# EAGLE design riffle-0.8 (EAGLE 7.2.0)
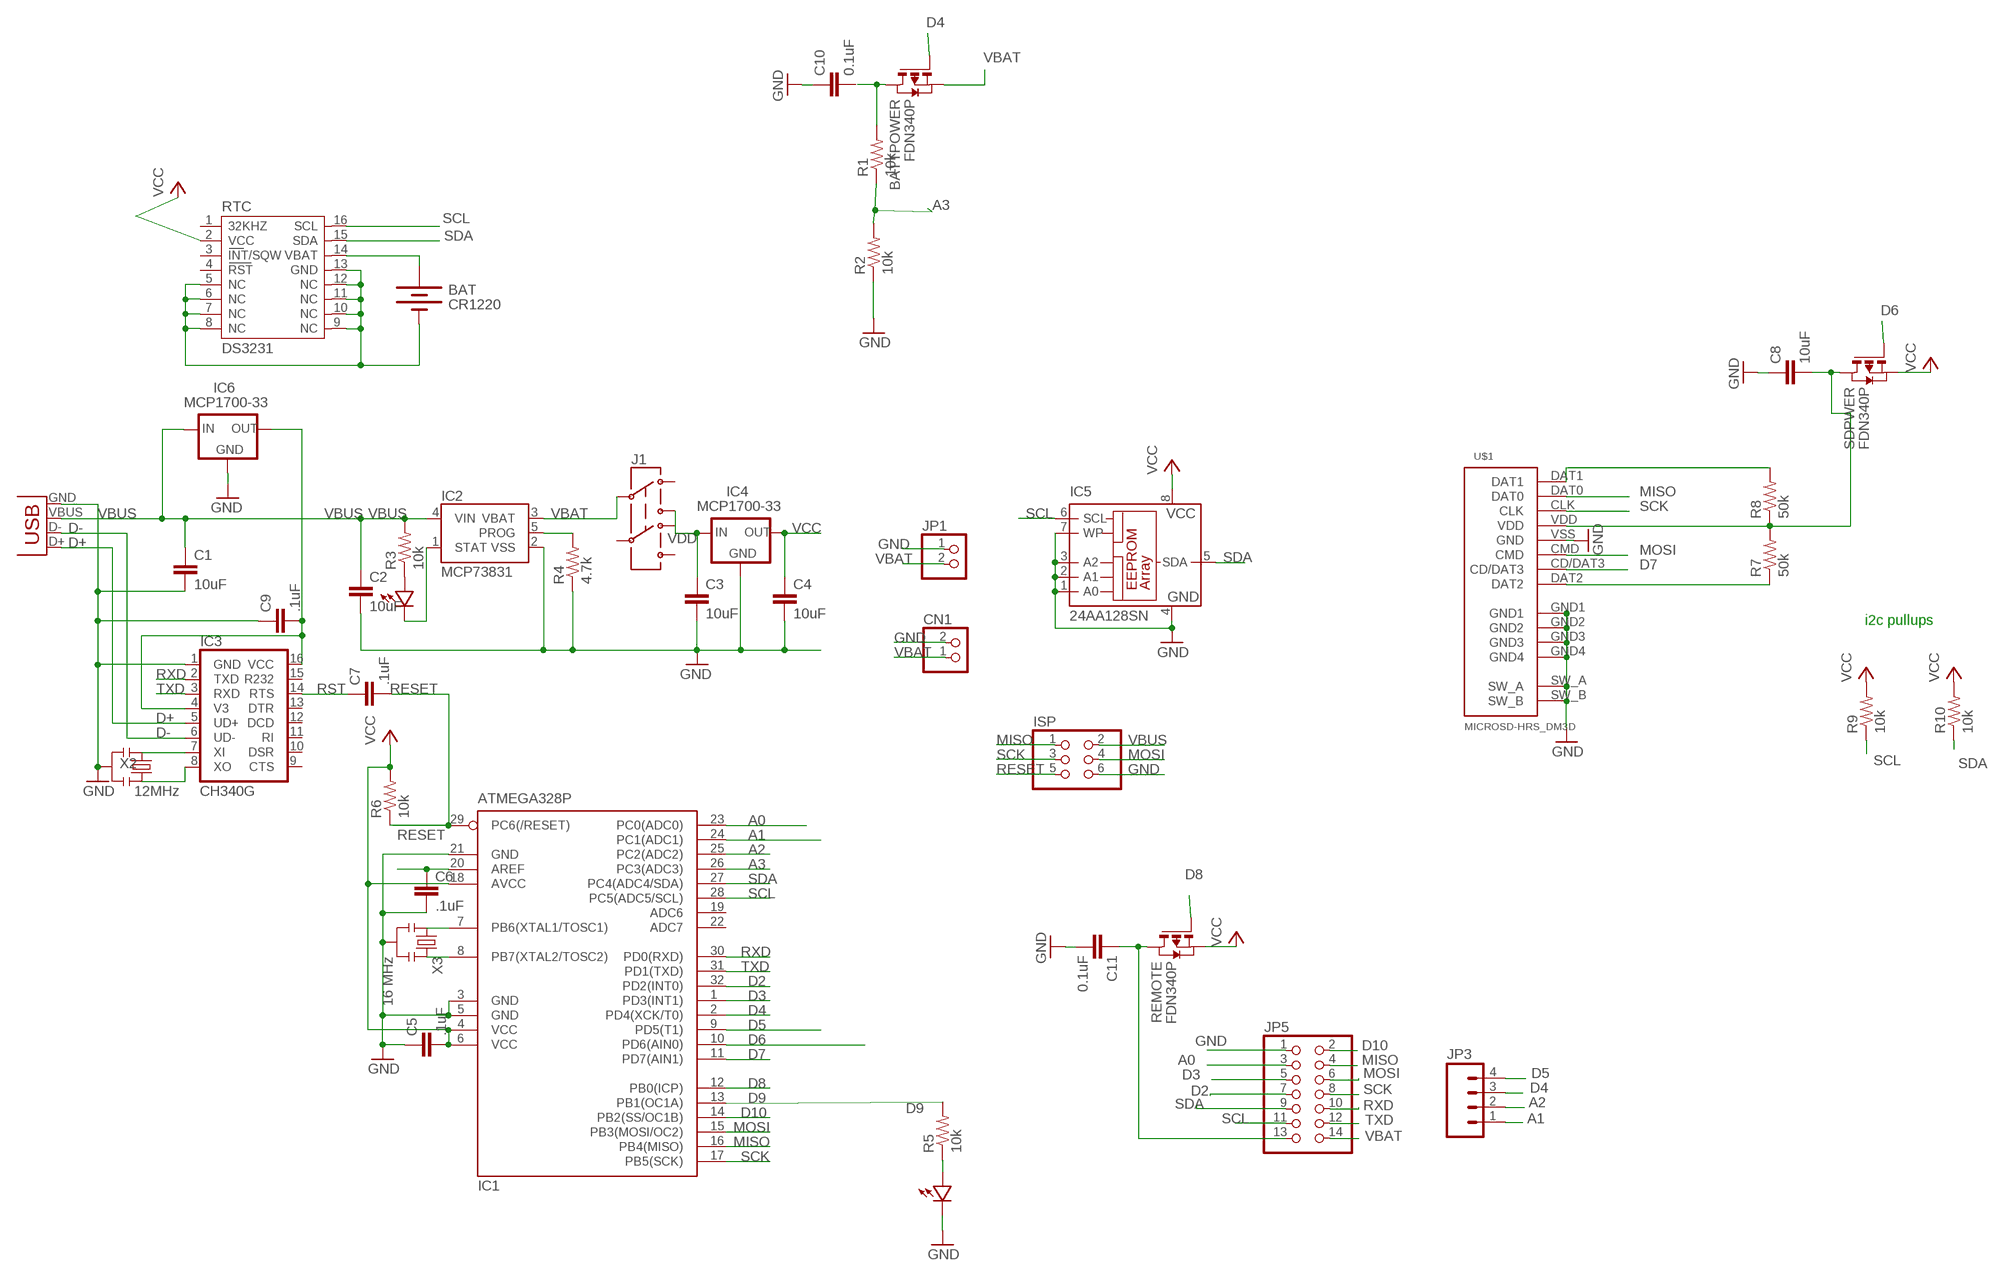
[diagram p0: schematic, sheet 1]

## Parts
BAT  CR1220  BATTERYBATTERY_12MM_SMT  [BATTCON_12MM_SMT]
BATTPOWER  FDN340P  PMOSSOT23  [SOT-23]
C1  10uF  CAP0402-CAP  [0402-CAP]
C2  10uF  CAP0402-CAP  [0402-CAP]
C3  10uF  CAP0402-CAP  [0402-CAP]
C4  10uF  CAP0402-CAP  [0402-CAP]
C5  .1uF  CAP0402-CAP  [0402-CAP]
C6  .1uF  CAP0402-CAP  [0402-CAP]
C7  .1uF  CAP0402-CAP  [0402-CAP]
C8  10uF  CAP0402-CAP  [0402-CAP]
C9  .1uF  CAP0402-CAP  [0402-CAP]
C10  0.1uF  CAP0402-CAP  [0402-CAP]
C11  0.1uF  CAP0402-CAP  [0402-CAP]
CHG  LED0603  [0603-LED]
CN1  JST_2PIN-SMT-RA  [JST-PH-2-SMT-RA]
IC1  ATMEGA328P  MEGA8-AI  [TQFP32-08]
IC2  MCP73831  [SOT23-5]
IC3  CH340G  [SO16]
IC4  MCP1700-33  MCP1700SOT89  [SOT89]
IC5  24AA128SN  [SO-08]
IC6  MCP1700-33  MCP1700SOT89  [SOT89]
ISP  PINHD-2X3  [2X03]
J1  AYZ0202  [AYZ0202]
JP1  PINHD-1X2  [1X02]
JP3  M04SMD  [1X04-SMD]
JP5  PINHD-2X7  [2X07]
R1  10k  RESISTOR0402-RES  [0402-RES]
R2  10k  RESISTOR0402-RES  [0402-RES]
R3  10k  RESISTOR0402-RES  [0402-RES]
R4  4.7k  RESISTOR0402-RES  [0402-RES]
R5  10k  RESISTOR0402-RES  [0402-RES]
R6  10k  RESISTOR0402-RES  [0402-RES]
R7  50k  RESISTOR0402-RES  [0402-RES]
R8  50k  RESISTOR0402-RES  [0402-RES]
R9  10k  RESISTOR0402-RES  [0402-RES]
R10  10k  RESISTOR0402-RES  [0402-RES]
REMOTE  FDN340P  PMOSSOT23  [SOT-23]
RTC  DS3231  [DS3231]
SDPWER  FDN340P  PMOSSOT23  [SOT-23]
STAT  LED0603  [0603-LED]
U$1  MICROSD-HRS_DM3D  [DM3D]
X1  USBSMD  [USB-MINIB]
X2  12MHz  RESONATORSMD  [RESONATOR-SMD]
X3  16 MHz  RESONATORSMD  [RESONATOR-SMD]

## Nets
A0: IC1.23(PC0(ADC0)) JP5.3
A1: IC1.24(PC1(ADC1)) JP3.1
A2: IC1.25(PC2(ADC2)) JP3.2
A3: IC1.26(PC3(ADC3)) R1.1 R2.2
AREF: C6.1 IC1.20(AREF)
D2: IC1.32(PD2(INT0)) JP5.7
D3: IC1.1(PD3(INT1)) JP5.5
D4: BATTPOWER.3(G) IC1.2(PD4(XCK/T0)) JP3.3
D5: IC1.9(PD5(T1)) JP3.4
D6: IC1.10(PD6(AIN0)) SDPWER.3(G)
D7: IC1.11(PD7(AIN1)) U$1.CD/DAT3
D8: IC1.12(PB0(ICP)) REMOTE.3(G)
D9: IC1.13(PB1(OC1A)) R5.2
D10: IC1.14(PB2(SS/OC1B)) JP5.2
D+: IC3.5(UD+) X1.D+
D-: IC3.6(UD-) X1.D-
GND: BAT.P$1(-) C1.2 C2.2 C3.2 C4.2 C5.1 C6.2 C8.1 C9.1 C10.1 C11.2 CN1.2 IC1.3(GND) IC1.5(GND) IC1.21(GND) IC2.2(VSS) IC3.1(GND) IC4.1(GND) IC5.1(A0) IC5.2(A1) IC5.3(A2) IC5.4(GND) IC5.7(WP) IC6.1(GND) ISP.6 JP1.1 JP5.1 R2.1 R4.1 RTC.5(NC) RTC.6(NC) RTC.7(NC) RTC.8(NC) RTC.9(NC) RTC.10(NC) RTC.11(NC) RTC.12(NC) RTC.13(GND) STAT.MINUS U$1.GND1 U$1.GND2 U$1.GND3 U$1.GND4 U$1.SW_A U$1.SW_B U$1.VSS(GND) X1.GND X2.2 X3.2
MISO: IC1.16(PB4(MISO)) ISP.1 JP5.4 U$1.DAT0
MOSI: IC1.15(PB3(MOSI/OC2)) ISP.4 JP5.6 U$1.CMD
N$1: CHG.PLUS R3.1
N$2: IC1.7(PB6(XTAL1/TOSC1)) X3.1
N$3: IC1.8(PB7(XTAL2/TOSC2)) X3.3
N$4: C8.2 R7.2 R8.1 SDPWER.1(D) U$1.VDD
N$5: CHG.MINUS IC2.1(STAT)
N$6: IC2.5(PROG) R4.2
N$7: C11.1 JP5.13 REMOTE.1(D)
N$8: C9.2 IC3.4(V3) IC3.16(VCC) IC6.3(OUT)
N$11: IC3.7(XI) X2.1
N$13: IC3.8(XO) X2.3
N$15: BATTPOWER.1(D) R1.2
N$16: R8.2 U$1.DAT1
N$17: R5.1 STAT.PLUS
N$18: R7.1 U$1.DAT2
RESET: C7.2 IC1.29(PC6(/RESET)) ISP.5 R6.1
RST: C7.1 IC3.14(RTS)
RTC_BATT: BAT.P$2(+) RTC.14(VBAT)
RXD: IC1.30(PD0(RXD)) IC3.2(TXD) JP5.10
SCK: IC1.17(PB5(SCK)) ISP.3 JP5.8 U$1.CLK
SCL: IC1.28(PC5(ADC5/SCL)) IC5.6(SCL) JP5.11 R9.1 RTC.16(SCL)
SDA: IC1.27(PC4(ADC4/SDA)) IC5.5(SDA) JP5.9 R10.1 RTC.15(SDA)
TXD: IC1.31(PD1(TXD)) IC3.3(RXD) JP5.12
VBAT [vcc]: BATTPOWER.2(S) CN1.1 IC2.3(VBAT) J1.2 JP1.2 JP5.14
VBUS [vcc]: C1.1 C2.1 IC2.4(VIN) IC6.2(IN) ISP.2 R3.2 X1.VBUS
VCC: C4.1 C5.2 IC1.4(VCC) IC1.6(VCC) IC1.18(AVCC) IC4.3(OUT) IC5.8(VCC) R6.2 R9.2 R10.2 REMOTE.2(S) RTC.2(VCC) SDPWER.2(S)
VDD: C3.1 IC4.2(IN) J1.1
Unconnected: C10.2 IC1.19(ADC6) IC1.22(ADC7) IC3.9(CTS) IC3.10(DSR) IC3.11(RI) IC3.12(DCD) IC3.13(DTR) IC3.15(R232) J1.3 J1.4 J1.5 J1.6 RTC.1(32KHZ) RTC.3(INT/SQW) RTC.4(RST)

## Notes on the sheet
- i2c pullups

## Library data of the parts
BAT = SparkFunNew:BATTERY: Battery Holders Various common sizes : AA, AAA, 20mm coin cell and 12mm coin cell.
BATTPOWER REMOTE SDPWER = zetex:PMOSSOT23: MOS FET; OC_FARNELL: unknown; OC_NEWARK: unknown
C1-C11 = SparkFun:CAP: Capacitor Standard 0603 ceramic capacitor, and 0.1" leaded capacitor.
CHG STAT = LowPowerLab:LED
CN1 = adafruit:JST_2PIN: JST 2-Pin Connectors of various flavors SMT-RA (S2B-PH-SM4) 4UConnector #17311 SMT (B2B-PH-SM4) THM-RA (S2B-PH) THM (B2B-PH)
IC1 = atmel:MEGA8: MICROCONTROLLER 8 Kbytes FLASH, 1 kbytes SRAM, 512 bytes EEPROM, USART, 6-channel 10 bit ADC, 2-channel 8 bit ADC Pin compatible with Atmega48, ATMega88, ATMega168 Source: avr.lbr; MPN: ATMEGA8-16AU; OC_FARNELL: 9171371; OC_NEWARK: 73M8863
IC2 = SparkFunNew:MCP73831: Microchip's MCP73831 Miniature single cell, fully integrated Li-Ion, Li-polymer charge management controller http://ww1.microchip.com/downloads/en/DeviceDoc/21984a.pdf
IC3 = SparkFunNew:CH340
IC4 IC6 = adafruit:MCP1700: VOLTAGE REGULATOR
IC5 = microchip:24*: Serial EEPROM I2C; MF: MICROCHIP; MPN: 24AA128-I/SN; OC_FARNELL: unknown; OC_NEWARK: 92C6842
ISP = pinhead:PINHD-2X3: PIN HEADER
J1 = SparkFunNew:AYZ0202: SPDT Slide Switch Simple SMD single-pull double-throw slide switch. Good for less than 350mA power switch, switching UARTs between devices, etc. Spark Fun Electronics SKU : COM-00597
JP1 = pinhead:PINHD-1X2: PIN HEADER
JP3 = SparkFun:M04: Header 4 Standard 4-pin 0.1" header. Use with straight break away headers (SKU : PRT-00116), right angle break away headers (PRT-00553), swiss pins (PRT-00743), machine pins (PRT-00117), and female headers (PRT-00115). Molex polarized connector foot print use with SKU : PRT-08231 with associated crimp pins and housings.
JP5 = pinhead:PINHD-2X7: PIN HEADER
R1-R10 = SparkFun:RESISTOR: Resistor Basic schematic elements and footprints for 0603, 1206, and PTH resistors.
RTC = _lh-library:DS3231
U$1 = hrs_DM3D-SF:MICROSD-HRS_DM3D
X1 = SparkFun:USB: USB Connectors USB-B-PTH is fully proven SKU : PRT-00139 USB-miniB is fully proven SKU : PRT-00587 USB-A-PCB is untested. USB-A-H is throughly reviewed, but untested. Spark Fun Electronics SKU : PRT-00437 USB-B-SMT is throughly reviewed, but untested. Needs silkscreen touching up. USB-A-S has not been used/tested USB-MB-H has not been used/tested
X2 = SparkFunNew:RESONATOR: Resonator Small SMD resonator. This is the itty bitty 10/20MHz resonators with built in caps. CSTCE10M0G55 and CSTCE20M0V53. Footprint has been reviewed closely but hasn't been tested yet.
X3 = SparkFun:RESONATOR: Resonator Small SMD resonator. This is the itty bitty 10/20MHz resonators with built in caps. CSTCE10M0G55 and CSTCE20M0V53. Footprint has been reviewed closely but hasn't been tested yet.

## Board
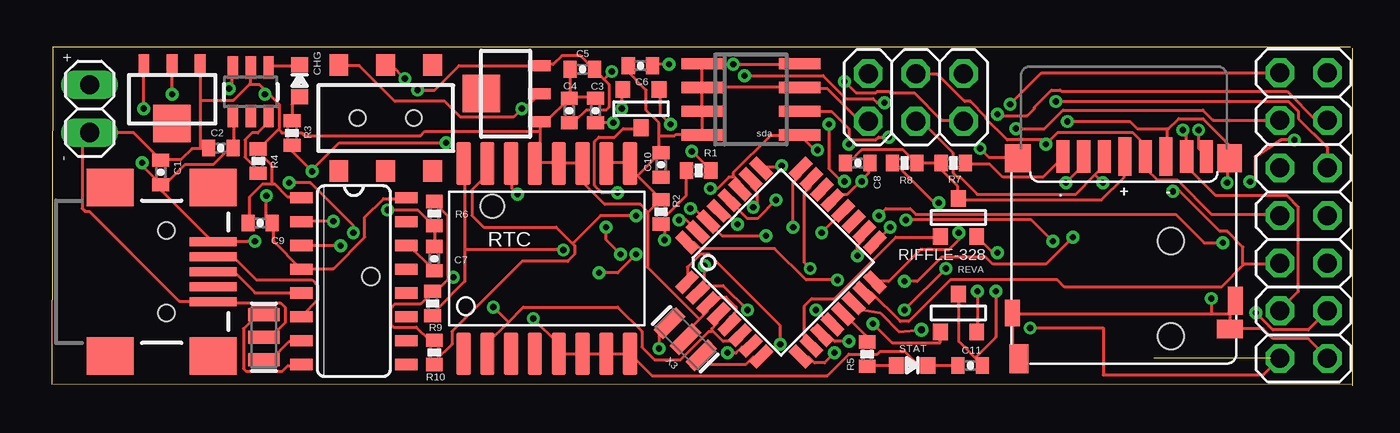
[diagram p1: board, top side]
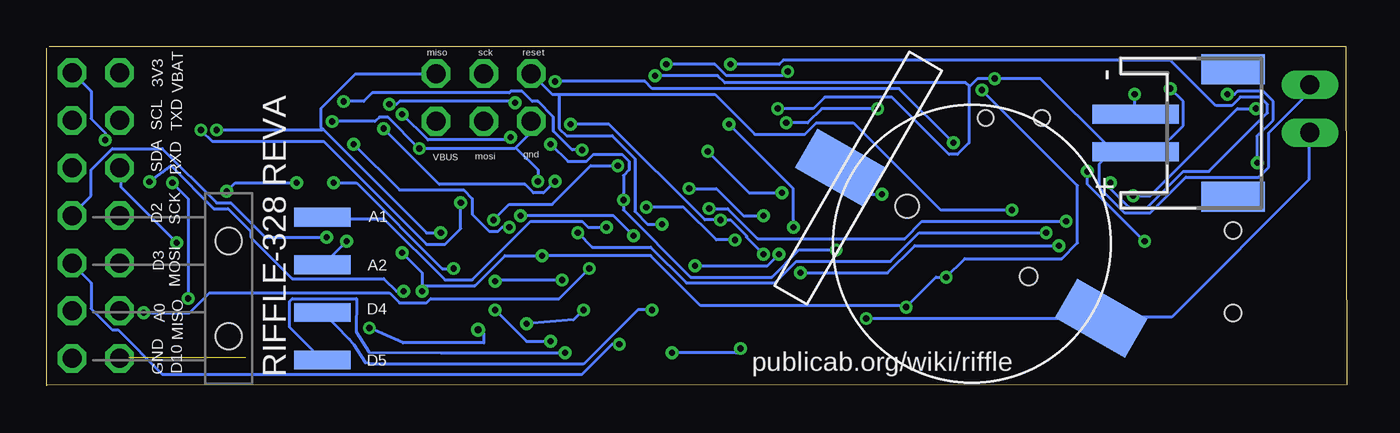
[diagram p2: board, bottom side, seen from below]

Size 69.4 x 18.09 mm. Coordinates in mm from the lower left corner, seen from the top.
Outline: 69.27,18.09 0.05,18.09 0,0.1 69.37,0.07
Outline: 69.4,0 69.4,18.01
Copper layers (1*16): Top 0.0356mm / dielectric 1.5011mm / Bottom 0.0356mm
Design rules "LaenPCBOrder": minimum track width 6mil, minimum drill 13mil, track to track 6mil, track to pad 6mil, pad to pad 6mil, via to via 6mil, smd to smd 6mil, copper to edge 15mil, drill to drill 6mil, minimum pad ring 7mil, minimum via ring 7mil, stop-mask expansion 3mil, vias tented up to drill 0mil, thermal gap 10mil

### Footprints (pad centres in the part's own frame; a part is rotated, then mirrored left to right if it is on the bottom)
BATTCON_12MM_SMT = smd 2.4 x 4.3: P$1 0,11.96 | smd 2.4 x 4.2: P$2 0,-4.1 | hole 0.95: 0,7.5 | hole 1.25: 0,0
SOT-23 = smd 0.787 x 0.889: 1 0.025,-1.016; 2 -0.94,1.016; 3 0.991,1.016
0402-CAP = smd 0.7 x 0.9: 1 -0.65,0; 2 0.65,0
0603-LED = smd 0.8 x 0.9: MINUS -0.85,0; PLUS 0.85,0
JST-PH-2-SMT-RA = smd 1 x 4.6: 1 1,-3.7; 2 -1,-3.7 | smd 1.6 x 3.4: NC1 -3.4,1.5; NC2 3.4,1.5
TQFP32-08 = smd 1.27 x 0.559: 1 -4.293,2.8; 2 -4.293,2; 3 -4.293,1.2; 4 -4.293,0.4; 5 -4.293,-0.4; 6 -4.293,-1.2; 7 -4.293,-2; 8 -4.293,-2.8; 17 4.293,-2.8; 18 4.293,-2; 19 4.293,-1.2; 20 4.293,-0.4; 21 4.293,0.4; 22 4.293,1.2; 23 4.293,2; 24 4.293,2.8 | smd 0.559 x 1.27: 9 -2.8,-4.293; 10 -2,-4.293; 11 -1.2,-4.293; 12 -0.4,-4.293; 13 0.4,-4.293; 14 1.2,-4.293; 15 2,-4.293; 16 2.8,-4.293; 25 2.8,4.293; 26 2,4.293; 27 1.2,4.293; 28 0.4,4.293; 29 -0.4,4.293; 30 -1.2,4.293; 31 -2,4.293; 32 -2.8,4.293
SOT23-5 = smd 0.55 x 1.2: 1 -0.95,-1.3; 2 0,-1.3; 3 0.95,-1.3; 4 0.95,1.3; 5 -0.95,1.3; 6 0,1.3
SO16 = smd 0.6 x 1.2: 1 -4.445,-2.8; 2 -3.175,-2.8; 3 -1.905,-2.8; 4 -0.635,-2.8; 5 0.635,-2.8; 6 1.905,-2.8; 7 3.175,-2.8; 8 4.445,-2.8; 9 4.445,2.8; 10 3.175,2.8; 11 1.905,2.8; 12 0.635,2.8; 13 -0.635,2.8; 14 -1.905,2.8; 15 -3.175,2.8; 16 -4.445,2.8
SOT89 = smd 0.58 x 1.2: 1 -1.5,-1.8; 2 0,-1.8; 3 1.5,-1.8 | smd 2 x 2: 4 0,1.3
SO-08 = smd 0.6 x 2.2: 1 -1.905,-2.6; 2 -0.635,-2.6; 3 0.635,-2.6; 4 1.905,-2.6; 5 1.905,2.6; 6 0.635,2.6; 7 -0.635,2.6; 8 -1.905,2.6
2X03 = drill 1.016 octagon: 1 -2.54,-1.27; 2 -2.54,1.27; 3 0,-1.27; 4 0,1.27; 5 2.54,-1.27; 6 2.54,1.27
AYZ0202 = smd 1 x 1.15: 1 -2.5,2.825; 2 0,2.825; 3 2.5,2.825; 4 -2.5,-2.825; 5 0,-2.825; 6 2.5,-2.825 | hole 0.85: 1.5,0; -1.5,0
1X02 = drill 1.016 long: 1 -1.27,0; 2 1.27,0
1X04-SMD = smd 1 x 3: 1 -3.81,5; 2 -1.27,5; 3 1.27,5; 4 3.81,5 | hole 1.4: -2.54,0; 2.54,0
2X07 = drill 1.016 octagon: 1 -7.62,-1.27; 2 -7.62,1.27; 3 -5.08,-1.27; 4 -5.08,1.27; 5 -2.54,-1.27; 6 -2.54,1.27; 7 0,-1.27; 8 0,1.27; 9 2.54,-1.27; 10 2.54,1.27; 11 5.08,-1.27; 12 5.08,1.27; 13 7.62,-1.27; 14 7.62,1.27
0402-RES = smd 0.7 x 0.9: 1 -0.65,0; 2 0.65,0
DS3231 = smd 0.762 x 2.286: 1 -4.445,-5.08; 2 -3.175,-5.08; 3 -1.905,-5.08; 4 -0.635,-5.08; 5 0.635,-5.08; 6 1.905,-5.08; 7 3.175,-5.08; 8 4.445,-5.08; 9 4.445,5.08; 10 3.175,5.08; 11 1.905,5.08; 12 0.635,5.08; 13 -0.635,5.08; 14 -1.905,5.08; 15 -3.175,5.08; 16 -4.445,5.08
DM3D = smd 0.7 x 1.75: CD/DAT3 8.15,0.45; CLK 4.85,0.45; CMD 7.05,0.45; DAT0 2.65,0.45; DAT1 1.6,0.45; DAT2 9.25,0.45 | smd 0.8 x 1.5: GND1 0.05,8.15 | smd 0.8 x 1.4: GND2 11.95,8.8 | smd 1.4 x 1.5: GND3 11.65,0.55 | smd 1.3 x 1.5: GND4 0.35,0.55 | smd 1 x 1.55: SW_A 11.6,11.25 | smd 1.4 x 1: SW_B 0.35,9.65 | smd 0.7 x 2.032: VDD 5.95,0.45; VSS 3.75,0.45
USB-MINIB = smd 2.5 x 0.5: D+ 2.5,0; D- 2.5,0.8; GND 2.5,-1.6; ID 2.5,-0.8; VBUS 2.5,1.6 | smd 2.5 x 2: GND@1 -3,-4.5; GND@2 -3,4.5; GND@3 2.5,4.5; GND@4 2.5,-4.5 | hole 0.9: 0,2.2; 0,-2.2
RESONATOR-SMD = smd 0.7 x 1.7: 1 -1.2,0; 2 0,0; 3 1.2,0

### Placement (x,y rotation side)
BAT  23.49,9.59 240 bottom
BATTPOWER  31.39,14.79 0 top
C1  5.79,11.39 90 top
C2  8.99,12.69 180 top
C3  28.99,14.69 90 top
C4  27.59,14.69 90 top
C5  28.29,16.89 0 top
C6  31.39,17.09 180 top
C7  20.39,6.79 90 top
C8  42.99,11.89 180 top
C9  11.09,8.69 0 top
C10  32.49,11.79 270 top
C11  48.99,1.09 180 top
CHG  13.19,16.29 270 top
CN1  7.59,13.49 270 bottom
IC1  38.89,6.59 45 top
IC2  10.59,15.69 180 top
IC3  16.09,5.59 270 top
IC4  24.19,15.59 90 top
IC5  37.29,15.29 270 top
IC6  6.39,15.29 180 top
ISP  46.09,15.39 180 top
J1  17.79,14.29 0 top
JP1  1.99,14.79 90 top
JP3  59.69,5.19 270 bottom
JP5  66.79,9.09 90 top
R1  34.49,11.49 0 top
R2  32.49,9.29 270 top
R3  12.79,13.49 270 top
R4  10.99,11.99 270 top
R5  43.49,1.69 90 top
R6  20.39,9.19 90 top
R7  48.09,11.89 180 top
R8  45.49,11.89 180 top
R9  20.29,4.39 90 top
R10  20.39,1.79 90 top
REMOTE  48.39,3.89 180 top
RTC  26.39,6.79 0 top
SDPWER  48.39,8.99 180 top
STAT  45.89,1.09 180 top
U$1  63.19,12.69 180 top
X1  6.09,6.09 0 top
X2  11.29,2.59 90 top
X3  33.79,2.49 315 top

### Tracks (layer width: path | path; a pad name or v marks a point on that pad's centre or on a via)
A0  (via drill 0.33)
  Top 0.152: v40.45,6.26 40.14,6.57 40.14,10.3 40.45,10.61 40.45,10.99 IC1.23 | v64.22,3.9 65.14,2.99 67.04,2.99 68.03,3.98 JP5.3
  Bottom 0.152: v40.45,6.26 42.05,4.66 48.91,4.66 49.14,4.43 50.58,4.43 51.12,4.97 60.72,4.97 61.79,3.9 v64.22,3.9
A1  (via drill 0.33)
  Top 0.152: v39.54,8.47 39.54,10.84 39.92,11.22 39.92,11.6 IC1.24
  Bottom 0.152: v39.54,8.47 40.53,8.47 40.83,8.78 43.57,8.78 46.7,5.65 48.15,5.65 51.42,8.93 54.62,8.93 JP3.1
A2  (via drill 0.33)
  Top 0.152: v38.93,11.75 38.85,11.67 37.86,11.67 IC1.25 | v45.56,8.85 52.26,8.85 v53.4,7.71
  Bottom 0.152: v38.93,11.75 40.37,11.75 42.43,9.69 44.72,9.69 v45.56,8.85 | v53.4,7.71 54.62,6.49 JP3.2
A3  (via drill 0.33)
  Top 0.152: R1.1 33.82,11.45 33.82,10.15 32.52,8.85 32.52,8.7 R2.2 32.52,8.63 32.68,8.47 v32.68,7.79 | v37.4,9.54 37.63,9.77 37.63,10.3 37.33,10.61 37.33,10.99 IC1.26
  Bottom 0.152: v37.4,9.54 35.42,9.54 33.67,7.79 v32.68,7.79
AREF  (via drill 0.33)
  Top 0.152: v32.91,17.16 32.07,17.16 C6.1 | v12.64,10.84 13.78,10.84 16.07,8.55 v16.07,8.17 | v41.06,8.17 42.2,9.31 IC1.20
  Bottom 0.152: v32.91,17.16 30.32,17.16 30.09,17.39 9.44,17.39 7,14.95 6.16,14.95 5.7,15.41 4.64,15.41 4.25,15.03 4.25,14.57 7.38,11.45 8.75,11.45 10.66,9.54 11.65,9.54 12.64,10.53 v12.64,10.84 | v16.07,8.17 22.85,8.17 24.37,6.64 29.4,6.64 30.54,5.5 35.27,5.5 37.17,7.41 40.3,7.41 v41.06,8.17
D2  (via drill 0.33)
  Top 0.152: v41.9,5.65 40.22,5.65 38.54,7.33 34.58,7.33 34.28,7.64 33.9,7.64 IC1.32 | v45.48,5.58 46.16,5.58 47.46,6.87 49.82,6.87 50.2,6.49 53.02,6.49 v54.47,7.94
  Bottom 0.152: v41.9,5.65 45.4,5.65 v45.48,5.58 | v54.47,7.94 57.75,7.94 59.58,9.77 60.34,9.77 63.23,12.66 65.9,12.66 67.04,11.52 67.04,10.15 68.03,9.16 JP5.7
D3  (via drill 0.33)
  Top 0.152: v38.85,2.23 38.85,3.22 35.04,7.03 34.58,7.03 33.9,6.34 33.9,5.58 IC1.1
  Bottom 0.152: v38.85,2.23 39.23,2.23 40.83,0.62 63.23,0.62 65.6,2.99 65.9,2.99 67.04,4.13 67.04,5.5 68.03,6.49 JP5.5
D4  (via drill 0.33)
  Top 0.152: v32.98,13.96 32.45,14.49 32.45,15.79 BATTPOWER.3 | v29.55,8.47 29.55,7.79 v30.32,7.03 | 34.81,5.35 v34.81,6.42 | 34.81,5.35 34.51,5.04 IC1.2 34.81,5.35 | v37.1,4.05 35.8,5.35 34.81,5.35
  Bottom 0.152: v32.98,13.96 29.55,10.53 v29.55,8.47 | v30.32,7.03 30.92,6.42 v34.81,6.42 | v37.1,4.05 37.86,4.05 40.75,1.16 52.02,1.16 52.39,1.22 52.99,2.19 53.27,2.5 54.62,3.9 JP3.3
D5  (via drill 0.33)
  Top 0.152: v41.75,1.77 41.21,1.23 40.68,1.23 40.37,1.54 39.99,1.54 IC1.9
  Bottom 0.152: v41.75,1.77 48.37,1.77 52.19,1.79 52.89,2.88 52.87,4.66 56.3,4.66 56.45,4.51 56.45,3.14 54.7,1.39 JP3.4
D6
  Top 0.152: SDPWER.3 47.38,7.94 45.02,7.94 41.75,4.66 40.53,4.66 40.14,4.28 40.14,2.45 40.45,2.15 IC1.10
D7  (via drill 0.33)
  Top 0.152: v42.51,2.38 41.75,2.38 41.44,2.68 41.14,2.68 IC1.11 | v47.69,6.26 v45.48,4.05 | v54.09,10.84 55,11.75 55,12.21 U$1.CD/DAT3
  Bottom 0.152: v42.51,2.38 43.8,2.38 v45.48,4.05 | v47.69,6.26 48.3,6.26 52.87,10.84 v54.09,10.84
D8  (via drill 0.33)
  Top 0.152: v43.8,3.32 44.81,2.31 47.38,2.31 REMOTE.3 | v40.75,4.05 41.59,3.22 IC1.12
  Bottom 0.152: v43.8,3.32 41.29,3.52 v40.75,4.05
D9
  Top 0.152: R5.2 43.42,2.38 43.42,2.68 42.28,3.83 IC1.13
D10  (via drill 0.33, 0.38 pad 0.38)  (1 unrouted)
  Top 0.152: IC1.14 43.08,4.09 44.19,3.89 45.19,2.89 v46.39,2.99 | v52.19,3.09 56.09,3.09 56.09,0.59 64.64,0.59 JP5.2 65.04,1.49
  Bottom 0.152: v46.39,2.99 46.09,2.79 46.09,2.29 50.39,2.29 51.49,2.79 v52.19,3.09
D+
  Top 0.152: IC3.5 13.25,4.97 10.81,4.97 9.74,6.04 8.6,6.04 X1.D+
D-
  Top 0.152: IC3.6 13.32,3.75 14.16,4.59 14.16,5.35 13.86,5.65 10.88,5.65 9.66,6.87 8.6,6.87 X1.D-
GND  (via drill 0.33)
  Top 0.152: C4.2 27.65,15.41 28.94,15.41 C3.2 | C5.1 27.65,16.86 27.65,15.48 C4.2 | C4.2 27.57,15.33 26.35,14.11 26.05,14.11 IC4.1 26.05,14.04 26.05,13.58 | 26.05,11.9 26.96,11.9 RTC.12 27.04,11.9 28.26,11.9 RTC.11 28.33,11.83 28.33,10.84 29.48,9.69 31.38,9.69 31.8,9.27 | 26.05,11.9 25.82,11.9 RTC.13 26.05,11.9 | 26.05,11.9 26.05,13.58 | 34.66,13.43 IC5.4 | IC5.4 34.66,13.5 34.66,14.65 IC5.3 34.66,14.72 34.66,15.86 IC5.2 | IC5.1 34.66,17.16 34.66,15.94 IC5.2 | 34.54,3.56 33.82,2.83 33.82,2.53 X3.2 | 34.54,3.56 34.96,3.98 34.96,4.36 IC1.3 35.04,4.43 35.34,4.74 35.95,4.74 36.49,4.21 36.49,3.98 36.18,3.67 36.18,3.29 IC1.5 | 31.23,11.22 30.85,11.6 30.85,11.83 RTC.9 30.77,11.9 29.63,11.9 RTC.10 | 31.23,11.22 32.45,10 R2.1 32.45,9.92 31.8,9.27 | 31.23,11.22 32.45,12.44 C10.1 32.37,12.44 32.37,13.35 | 32.37,13.35 32.37,14.04 31.69,14.72 31.69,15.79 30.77,16.7 30.77,17.08 C6.2 | 34.54,3.56 31.76,6.34 31.76,9.24 31.8,9.27 | 32.37,13.35 33.21,13.35 33.29,13.43 34.58,13.43 IC5.4 | U$1.SW_A 51.57,1.46 51.27,1.77 51.27,3.83 U$1.GND2 51.35,3.83 61.86,3.83 | 62.85,3.83 62.85,4.28 63.08,4.51 U$1.GND1 62.85,3.83 | 62.85,3.83 62.85,3.06 U$1.SW_B 62.93,3.06 64.61,3.06 65.14,2.53 67.04,2.53 68.03,1.54 JP5.1 | 62.85,3.83 61.86,3.83 | 59.54,13.69 59.5,13.66 59.5,12.28 U$1.VSS | 59.54,13.69 60.11,14.26 61.4,14.26 62.78,12.89 62.78,12.21 U$1.GND4 62.7,12.21 v62.7,10.84 | 43.15,10.95 42.43,10.23 41.97,10.23 41.67,9.92 IC1.21 | 43.15,10.95 43.57,11.37 43.57,11.83 C8.1 | v49.52,12.66 49.97,12.21 51.5,12.21 U$1.GND3 | ISP.6 43.5,14.19 43.04,14.19 41.36,15.86 39.92,15.86 IC5.7 39.84,15.94 34.73,15.94 IC5.2
  Top 0.152: v43.19,10.91 43.15,10.95 | v54.17,14.11 57.52,14.11 57.9,13.73 59.5,13.73 59.54,13.69 | v61.86,4.66 61.86,3.83 | C11.2 48.3,1.08 46.77,1.08 STAT.MINUS 46.7,1.16 46.16,1.16 45.48,1.84 44.18,1.84 44.03,1.69 42.51,1.69 41.36,0.55 31.99,0.55 30.85,1.69 RTC.8 30.77,1.69 29.63,1.69 RTC.7 29.55,1.69 28.33,1.69 RTC.6 28.26,1.69 27.04,1.69 RTC.5 26.96,1.77 26.96,2.3 v25.67,3.6 | X2.2 11.34,2.61 11.65,2.61 12.41,3.37 12.41,4.21 12.18,4.43 8.6,4.43 X1.GND 8.52,4.51 6.77,4.51 1.97,9.31 1.74,9.31 1.59,9.46 1.59,12.97 2.04,13.43 JP1.1 2.04,13.5 4.33,13.5 5.78,12.05 C1.2 5.85,12.05 6.85,12.05 7.46,12.66 7.91,12.66 | 11.72,10.76 11.87,10.76 12.56,10.07 13.25,10.07 IC3.1 13.32,10.07 | 11.72,10.76 11.19,10.76 10.5,10.07 10.5,8.7 C9.1 | 11.72,10.76 11.72,11.75 11.04,12.44 11.04,12.59 R4.1 11.04,12.66 12.07,13.69 | 7.91,12.66 8.29,12.66 C2.2 | 7.91,12.66 7.91,15.26 | 7.91,15.26 7.91,17.08 IC6.1 | 10.54,16.13 9.66,15.26 7.91,15.26 | 10.54,16.13 10.58,16.17 10.58,16.93 IC2.2 | 12.07,13.69 12.1,13.73 12.1,15.03 11.46,15.67 | 11.46,15.67 11.04,16.09 10.58,16.09 10.54,16.13 | 11.46,15.67 v11.34,15.56 | 26.05,13.58 19.88,13.58 19.65,13.35 13.47,13.35 13.32,13.5 12.26,13.5 12.07,13.69
  Bottom 0.152: 44.37,12.7 43.57,13.5 43.57,14.11 ISP.6 | 44.37,12.7 44.41,12.66 v49.52,12.66 51.19,14.34 51.65,14.34 51.88,14.11 v54.17,14.11 | v43.19,10.91 43.19,11.52 44.37,12.7 | v61.86,4.66 61.86,10 v62.7,10.84 | JP1.1 2.04,13.5 2.04,10.99 9.36,3.67 13.09,3.67 BAT.P$1 13.17,3.6 v25.67,3.6 | v11.34,15.56 11.34,14.49 CN1.2
MISO  (via drill 0.33)
  Top 0.152: JP5.4 65.52,4.05 66.51,5.04 66.51,9.54 65.9,10.15 62.09,10.15 60.57,11.67 60.57,12.21 U$1.DAT0 60.49,12.28 60.49,13.5 v60.34,13.66 | v48.37,8.17 48.37,7.79 47.84,7.25 46.32,7.25 44.64,5.58 43.95,5.58 IC1.16
  Bottom 0.152: v48.37,8.17 49.14,8.17 54.66,13.69 | 54.66,13.69 54.78,13.81 54.78,14.8 52.95,16.63 48.68,16.63 ISP.1 | v60.34,13.66 54.7,13.66 54.66,13.69
MOSI  (via drill 0.33)
  Top 0.152: 55.65,11.25 54.62,10.23 49.37,10.23 48.45,11.14 48.3,11.14 48.07,11.37 48.07,12.44 46.39,14.11 ISP.4 | 55.65,11.25 56.07,11.67 56.07,12.21 U$1.CMD | 63.58,6.45 63.61,6.49 65.44,6.49 JP5.6 | 63.58,6.45 62.4,5.27 54.01,5.27 53.63,5.65 47.92,5.65 45.71,3.44 45.25,3.44 43.73,4.97 IC1.15 | v56.07,10.84 55.65,11.25 | v59.8,10.38 60.19,10.38 62.32,8.24 62.7,8.24 63.54,7.41 63.54,6.49 63.58,6.45
  Bottom 0.152: v56.07,10.84 59.35,10.84 v59.8,10.38
N$1
  Top 0.152: R3.1 12.79,14.19 12.79,15.03 13.17,15.41 CHG.PLUS
N$2  (via drill 0.33)
  Top 0.152: v36.03,1.77 36.49,1.77 36.79,2.07 37.25,2.07 IC1.7 | v32.37,2 32.37,2.76 32.91,3.29 X3.1
  Bottom 0.152: v36.03,1.77 32.6,1.77 v32.37,2
N$3
  Top 0.152: IC1.8 37.78,1.54 37.4,1.54 37.02,1.16 35.12,1.16 34.66,1.62 X3.3
N$4
  Top 0.152: C8.2 42.35,11.9 42.51,11.9 43.19,12.59 45.4,12.59 46.09,11.9 R8.1 46.16,11.9 47.38,11.9 R7.2 47.46,11.83 47.46,11.52 48.3,10.68 48.3,10.07 SDPWER.1 48.37,10 48.45,9.92 55.99,9.92 57.21,11.14 57.21,12.21 U$1.VDD
N$5
  Top 0.152: CHG.MINUS 13.17,17.08 11.65,17.08 11.57,17.01 IC2.1
N$6
  Top 0.152: R4.2 10.96,11.37 10.96,11.52 10.27,12.21 10.27,13.12 10.66,13.5 10.96,13.5 11.49,14.04 11.49,14.34 IC2.5
N$7  (via drill 0.33)
  Top 0.152: REMOTE.1 48.37,4.89 48.37,2.38 49.59,1.16 C11.1 49.29,1.54 50.36,2.61 v50.36,5.04 | v63.92,10.89 64.2,11.17 64.2,12.23 65.6,13.12 v66.28,13.12
  Bottom 0.152: v50.36,5.04 50.74,5.04 51.42,5.73 56.3,5.73 58.51,7.94 58.51,8.24 59.73,9.46 60.49,9.46 62.78,11.75 v63.92,10.89 | v66.28,13.12 66.28,13.5 67.04,14.26 67.04,15.71 68.03,16.7 JP5.13
N$8  (via drill 0.33)
  Top 0.152: v4.86,14.8 4.86,17.08 IC6.3 | v11.42,10.15 11.42,9.01 11.72,8.7 C9.2 11.8,8.63 11.8,7.71 13.25,6.26 IC3.4 13.32,6.26 15,6.26 16.68,7.94 16.68,9.01 17.67,10 18.89,10 IC3.16
  Bottom 0.152: v4.86,14.8 5.85,14.8 10.5,10.15 v11.42,10.15
N$11
  Top 0.152: IC3.7 13.25,2.38 12.64,2.38 11.72,1.46 11.34,1.46 X2.1
N$13
  Top 0.152: IC3.8 13.25,1.08 12.56,1.08 12.26,0.78 10.35,0.78 10.2,0.93 10.2,3.06 10.88,3.75 11.27,3.75 X2.3
N$15  (via drill 0.33)
  Top 0.152: v30.16,10.3 29.32,10.3 28.94,10.68 28.94,13.05 29.17,13.27 30.01,13.27 30.47,13.73 31.38,13.73 BATTPOWER.1 | v34.13,12.51 35.12,11.52 R1.2
  Bottom 0.152: v30.16,10.3 31.92,10.3 v34.13,12.51
N$16  (via drill 0.33)
  Top 0.152: v47.31,9.77 47.08,9.77 45.02,11.83 44.87,11.83 R8.2 | v61.18,13.66 61.18,12.66 61.56,12.28 U$1.DAT1
  Bottom 0.152: v47.31,9.77 47.31,8.4 48.15,7.56 49.14,7.56 54.62,13.05 60.57,13.05 v61.18,13.66
N$17
  Top 0.152: R5.1 43.5,1.08 45.02,1.08 STAT.PLUS
N$18
  Top 0.152: R7.1 48.76,11.83 50.05,11.83 50.74,11.14 52.87,11.14 53.94,12.21 U$1.DAT2
RESET  (via drill 0.33)
  Top 0.152: C7.2 20.41,7.48 20.41,8.47 R6.1 20.33,8.55 19.49,9.39 v17.89,9.39 | v36.56,8.63 35.88,9.31 35.57,9.31 IC1.29
  Bottom 0.152: v17.89,9.39 21.7,9.39 26.35,14.04 28.33,14.04 28.94,13.43 31.61,13.43 33.74,15.56 42.05,15.56 | 42.05,15.56 42.43,15.56 43.5,16.63 ISP.5 | v36.56,8.63 37.33,8.63 38.01,9.31 38.01,12.13 39.23,13.35 41.67,13.35 42.05,13.73 42.05,15.56
RST
  Top 0.152: C7.1 20.33,6.19 18.96,7.56 IC3.14
RTC_BATT  (via drill 0.33)
  Top 0.152: v24.83,10.23 24.52,10.53 24.52,11.83 RTC.14
  Bottom 0.152: v24.83,10.23 25.59,10.23 26.96,11.6 BAT.P$2
RXD  (via drill 0.33)
  Top 0.152: v15,8.78 13.32,8.78 IC3.2 | v34.05,9.46 34.28,9.46 34.96,8.78 IC1.30 35.04,8.7 35.73,8.02 v38.09,8.02 | v62.47,7.64 61.48,7.64 59.96,9.16 46.09,9.16 45.78,9.46 44.49,9.46 v44.11,9.08
  Bottom 0.152: v15,8.78 22.7,8.78 23.61,7.86 31.46,7.86 33.06,9.46 v34.05,9.46 | v62.47,7.64 65.44,10.61 65.44,11.6 JP5.10 | v44.11,9.08 39.15,9.08 v38.09,8.02
SCK  (via drill 0.33)
  Top 0.152: v44.72,8.47 43.95,7.71 IC1.17 | ISP.3 46.09,16.63 47.23,16.63 48.68,15.18 48.98,15.18 49.82,14.34 49.82,14.26 50.97,13.12 52.87,13.12 53.02,12.97 v53.02,12.89 53.63,13.5 57.67,13.5 58.28,12.89 58.28,12.28 U$1.CLK 58.36,12.21 58.36,11.6 58.97,10.99 60.03,10.99 61.86,9.16 65.44,9.16 JP5.8
  Bottom 0.152: v44.72,8.47 45.1,8.47 45.33,8.24 45.78,8.24 46.7,9.16 46.7,10 47.16,10.45 50.58,10.45 v53.02,12.89
SCL  (via drill 0.33)
  Top 0.152: 22.01,7.25 22.01,11.83 RTC.16 | 22.01,7.25 22.01,5.58 20.33,3.9 20.33,3.75 R9.1 | v38.62,9.92 37.63,8.93 37.1,8.93 36.18,9.85 IC1.28 | 42.51,13.12 42.51,13.73 41.59,14.65 39.92,14.65 IC5.6 | v50.43,14.49 50.51,14.42 52.03,14.42 52.41,14.8 52.41,14.87 53.33,15.79 53.78,15.79 53.86,15.71 65.9,15.71 67.42,14.19 68.03,14.19 JP5.11 | v44.64,13.27 44.11,13.27 43.95,13.12 42.51,13.12 | 42.51,13.12 v42.51,12.89 | v27.27,7.25 22.01,7.25
  Bottom 0.152: v42.51,12.89 41.59,11.98 40.6,11.98 40.22,12.36 38.7,12.36 38.32,11.98 38.32,11.52 38.62,11.22 v38.62,9.92 38.62,9.39 35.04,5.81 30.7,5.81 29.25,7.25 v27.27,7.25 | v50.43,14.49 49.06,13.12 44.79,13.12 v44.64,13.27
SDA  (via drill 0.33)
  Top 0.152: 27.76,7.6 26.89,8.47 23,8.47 22.39,9.08 22.39,10.45 23.15,11.22 23.15,11.83 RTC.15 | 27.76,7.6 27.88,7.48 27.88,7.03 27.5,6.64 25.06,6.64 21.32,2.91 21.32,2.23 20.41,1.31 20.41,1.16 R10.1 | 36.37,11.18 36.33,11.22 36.33,11.37 38.32,13.35 39.84,13.35 IC5.5 39.92,13.35 40.68,12.59 v40.83,12.59 | 36.37,11.18 36.64,10.91 36.64,10.53 IC1.27 | v53.56,15.18 65.98,15.18 66.51,14.65 66.51,14.26 68.03,12.74 68.03,11.67 JP5.9 | 27.76,7.6 29.25,9.08 v31.15,9.08 | v35.12,10.53 35.5,10.53 36.11,11.14 36.33,11.14 36.37,11.18
  Bottom 0.152: v53.56,15.18 52.49,15.18 52.03,15.64 44.72,15.64 44.64,15.71 44.03,15.71 43.5,15.18 43.19,15.18 42.35,14.34 42.35,13.58 41.36,12.59 v40.83,12.59 | v31.15,9.08 32.22,9.08 33.67,10.53 v35.12,10.53
TXD  (via drill 0.33)
  Top 0.152: v15.38,7.48 13.32,7.48 IC3.3 | v29.17,6.04 30.16,6.04 v31.15,7.03 | v33.44,8.85 33.82,8.85 34.43,8.24 IC1.31 | v51.42,13.73 52.95,13.73 53.94,14.72 61.4,14.72 61.94,14.19 65.44,14.19 JP5.12 | v42.28,10.91 42.13,10.91 41.44,11.6 v41.44,13.96
  Bottom 0.152: v15.38,7.48 23.08,7.48 24.52,6.04 v29.17,6.04 | v31.15,7.03 32.07,7.94 32.07,8.02 32.91,8.85 v33.44,8.85 34.28,8.85 39.38,13.96 v41.44,13.96 | v51.42,13.73 48.45,10.76 43.88,10.76 43.42,10.3 42.89,10.3 v42.28,10.91
VBAT  (via drill 0.33)
  Top 0.152: v30.39,14.8 30.39,15.79 BATTPOWER.2 | v18.81,16.4 18.12,17.08 17.82,17.08 J1.2 | v9.44,15.86 9.59,16.02 9.59,16.93 IC2.3 | v51.12,15.03 52.79,16.7 65.44,16.7 JP5.14 | v44.41,15.1 44.03,15.1 43.8,15.33 42.35,15.33 41.14,16.55 v36.94,16.55
  Bottom 0.152: v30.39,14.8 28.49,14.8 27.88,15.41 24.3,15.41 21.25,12.36 20.79,12.36 20.18,12.97 20.18,15.94 20.14,15.98 | 20.14,15.98 19.72,16.4 v18.81,16.4 16.37,16.4 12.48,12.51 11.34,12.51 CN1.1 | v9.44,15.86 8.75,15.18 8.75,13.88 10.12,12.51 11.27,12.51 CN1.1 | JP1.2 1.99,16.02 2.04,15.64 4.18,13.5 4.18,11.67 4.71,11.14 8.6,11.14 10.5,9.24 11.87,9.24 13.25,10.61 13.25,11.83 12.56,12.51 CN1.1 | v51.12,15.03 50.74,15.03 50.58,15.18 44.49,15.18 v44.41,15.1 | v36.94,16.55 33.59,16.55 33.21,16.17 20.33,16.17 20.14,15.98
VBUS  (via drill 0.33)
  Top 0.152: IC2.4 9.66,14.34 9.66,12.74 C2.1 9.59,12.66 9.44,12.66 8.6,11.83 7.07,11.83 5.93,10.68 C1.1 | C1.1 5.85,10.68 5.85,10.38 8.52,7.71 X1.VBUS 8.6,7.71 v10.81,7.71 | R3.2 12.79,12.82 12.79,12.51 v13.86,11.45 13.86,11.52 15.3,12.97 v21.02,12.97 | v6.39,15.56 IC6.2 | v4.79,11.9 4.79,11.75 5.78,10.76 C1.1 | v42.28,16.25 42.89,15.64 43.95,15.64 44.03,15.71 44.64,15.71 44.72,15.64 46.01,15.64 47.46,14.19 48.6,14.19 ISP.2
  Bottom 0.152: v13.86,11.45 13.86,10.76 v10.81,7.71 | v6.39,15.56 6.01,15.56 5.85,15.71 4.48,15.71 3.95,15.18 3.95,14.19 4.79,13.35 v4.79,11.9 | v42.28,16.25 37.48,16.25 37.1,15.86 23.91,15.86 v21.02,12.97
VCC  (via drill 0.33)
  Top 0.152: 39.92,17.24 IC5.8 39.84,17.16 v36.33,17.16 | 29.44,16.36 28.94,16.86 C5.2 28.87,16.93 28.18,17.62 27.19,17.62 26.73,17.16 26.05,17.16 IC4.3 25.97,17.08 21.7,17.08 20.41,15.79 v19.49,15.79 | 29.44,16.36 29.71,16.09 29.71,14.87 29.55,14.72 28.49,14.72 27.88,14.11 27.65,14.11 C4.1 | 29.44,16.36 v29.86,16.78 | v49.37,5.04 49.37,2.91 REMOTE.2 | v50.43,7.1 50.2,7.1 49.37,7.94 SDPWER.2 | v42.96,6.95 42.96,7.48 43.27,7.79 43.27,8.17 IC1.18 | 21.09,5.81 21.09,9.08 20.41,9.77 R6.2 | 21.09,5.81 21.09,5.65 20.49,5.04 20.33,5.04 R9.2 20.26,4.97 19.65,4.36 18.28,4.36 18.05,4.13 18.05,3.29 18.2,3.14 19.42,3.14 20.1,2.45 20.33,2.45 R10.2 | 35.23,2.95 35.8,2.38 36.33,2.38 36.64,2.68 IC1.6 | 35.23,2.95 35.19,2.99 35.19,3.06 35.5,3.37 35.5,3.83 IC1.4 | 24.33,3.41 23.23,2.3 23.23,1.77 RTC.2 | 24.33,3.41 25.13,4.21 30.16,4.21 31.46,2.91 31.46,2.07 32.14,1.39 33.52,1.39 35.04,2.91 35.19,2.91 35.23,2.95 | v21.4,5.81 21.09,5.81 | 24.33,3.41 v23.53,4.21
  Bottom 0.152: v36.33,17.16 33.74,17.16 33.13,16.55 30.09,16.55 v29.86,16.78 | 49.37,5.35 49.37,6.04 v50.43,7.1 | 49.37,5.35 46.55,5.35 44.95,6.95 v42.96,6.95 37.17,6.95 34.51,4.28 23.53,4.28 v23.53,4.21 21.93,5.81 v21.4,5.81 20.41,6.8 15.23,6.8 14.39,7.64 14.39,10.68 v19.49,15.79 | 49.37,5.35 v49.37,5.04
VDD  (via drill 0.33)
  Top 0.152: v29.93,14.04 29.02,14.04 C3.1 | IC4.2 25.97,15.56 25.21,14.8 v25.06,14.8 24.6,14.34 21.78,14.34 20.94,15.18 18.28,15.18 16.37,17.08 15.3,17.08 J1.1
  Bottom 0.152: v29.93,14.04 28.79,14.04 28.03,14.8 v25.06,14.8

### Text on the board
tNames: + | sda | - | RIFFLE-328 | REVA
bNames: reset | sck | miso | VBAT | 3V3 | TXD | SCL | RXD | gnd | mosi | VBUS | SDA | A1 | SCK | D2 | A2 | D3 | MOSI | D4 | A0 | D5 | MISO | publicab.org/wiki/riffle | D10 | GND | RIFFLE-328 REVA